# Altium schematic sheet logi-edu-top.SchDoc: LOGi-EDU Top
size A; Organization: Michael Jones; DocumentNumber: 1; SheetNumber: 1; SheetTotal: 2
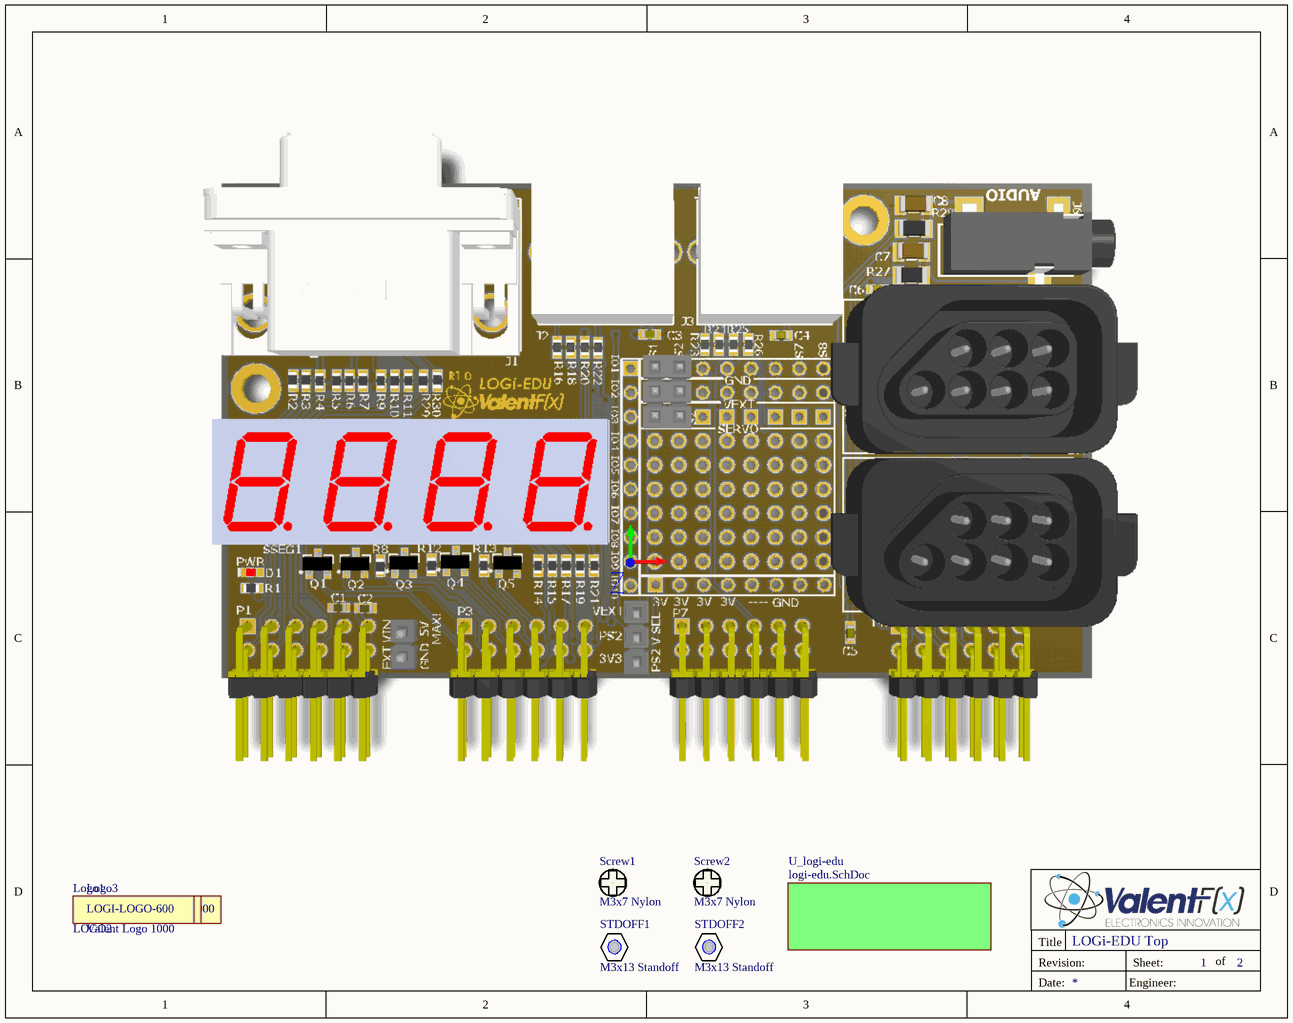
[diagram p0: logi-edu-top.SchDoc]

## Parts
Logo1  Valent Logo 500  [VALENTFX_500-SolderMask]  (value not drawn)  (no BOM)
LOGO2  LOGI-600  [LOGI-600-SILK]  (value not drawn)  (no BOM)
Logo3  Valent Logo 1000  [ValentFX_1000-SolderMask]  (no BOM)
Screw1  M3x7 Nylon  (mechanical)
Screw2  M3x7 Nylon  (mechanical)
STDOFF1  M3x13 Standoff  (mechanical)
STDOFF2  M3x13 Standoff  (mechanical)

## Sub-sheets
U_logi-edu = logi-edu.SchDoc: no entries

## Nets

Not connected (* = marked no-connect by the designer): Screw1 1; Screw2 1

## Notes on the sheet
- Title
- Revision:
- Sheet:
- of
- Date:
- Engineer:
- (in symbol LOGI-600) LOGI-LOGO-600
- (in symbol Valent Logo 500) VALENTFX-LOGO-500
- (in symbol Valent Logo 1000) VALENTFX-LOGO-1000

## Library data of the parts
Screw1 Screw2 = M3x7 - Nylon - 29341: Nylon MACHINE SCREW PAN SLOTTED M3; Manufacturer: Keystone Electronics; Manufacturer Part Number: 29341; Screw Head Type: Pan Head; Head Height: 0.067" (1.70mm); Supplier 1: Digi-Key; RoHS: RoHS Compliant; Category: Hardware, Fasteners, Accessories; Stock 1: 13272; Pricing 1: 1=0.19, 10=0.175, 50=0.1306, 100=0.1213, 250=0.10728, 500=0.10264, 1000=0.08397, 2500=0.07697, 5000=0.07464 (USD); Type: Machine Screw; Drive Type: Slotted; Features: -; Thread Size: M3; Head Diameter: -; Length - Below Head: 0.236" (6.00mm); Length - Overall: 0.303" (7.70mm); Material: Nylon; Plating: -; ComponentLink1URL: http://www.keyelco.com/product-pdf.cfm?p=4583; ComponentLink1Description: http://www.keyelco.com/product-pdf.cfm?p=4583; Supplier Part Number 1: 29341K-ND
STDOFF1 STDOFF2 = STDOFF - R30-1611300: HEX STANDOFF M3 NYLON 13MM; Manufacturer: Harwin Inc; Threaded/Unthreaded: Threaded; Gender: Female, Female; Thread/Screw/Hole Size: M3 Thread; Between Board Height: 0.512" (13.00mm); Supplier 1: Digi-Key; Manufacturer Part Number: R30-1611300; RoHS: RoHS Compliant; Category: Hardware, Fasteners, Accessories; Stock 1: 1279; Pricing 1: 1=0.46, 5=0.39, 10=0.325, 25=0.3056, 50=0.2926, 100=0.26, 250=0.247, 500=0.234, 1000=0.221 (USD); Type: Hex Standoff; Diameter - Outside: 0.217" (5.50mm) Hex; Length - Overall: 0.512" (13.00mm); Features: -; Material: Nylon; Plating: -; Color: Natural; Weight: -; ComponentLink1URL: http://www.harwin.com/include/downloads/drawings/R30-161.PDF; ComponentLink1Description: http://www.harwin.com/include/downloads/drawings/R30-161.PDF; Supplier Part Number 1: 952-2186-ND; Value: M3x13 Standoff